# Altium schematic sheet 7segment.SchDoc
size A
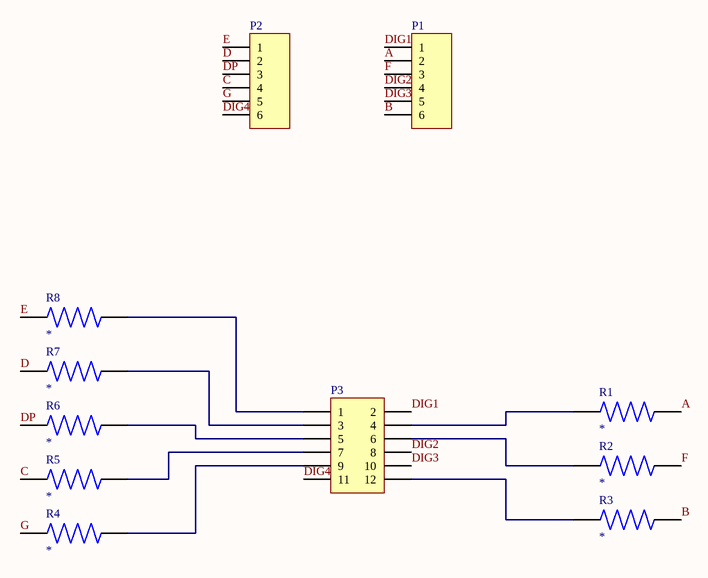
[diagram p0: 7segment.SchDoc]

## Parts
P1  Header 6  [HDR1X6]  (value not drawn)
P2  Header 6  [HDR1X6]  (value not drawn)
P3  Header 6X2  [HDR2X6]  (value not drawn)
R1  1623401-1  [RESC2012X65N]  (value not drawn)
R2  1623401-1  [RESC2012X65N]  (value not drawn)
R3  1623401-1  [RESC2012X65N]  (value not drawn)
R4  1623401-1  [RESC2012X65N]  (value not drawn)
R5  1623401-1  [RESC2012X65N]  (value not drawn)
R6  1623401-1  [RESC2012X65N]  (value not drawn)
R7  1623401-1  [RESC2012X65N]  (value not drawn)
R8  1623401-1  [RESC2012X65N]  (value not drawn)

## Nets
A: P1.2 R1.2
B: P1.6 R3.2
C: P2.4 R5.2
D: P2.2 R7.2
DIG1: P1.1 P3.2
DIG2: P1.4 P3.8
DIG3: P1.5 P3.10
DIG4: P2.6 P3.11
DP: P2.3 R6.2
E: P2.1 R8.2
F: P1.3 R2.2
G: P2.5 R4.2
NetP3_1: P3.1 R8.1
NetP3_3: P3.3 R7.1
NetP3_4: P3.4 R1.1
NetP3_5: P3.5 R6.1
NetP3_6: P3.6 R2.1
NetP3_7: P3.7 R5.1
NetP3_9: P3.9 R4.1
NetP3_12: P3.12 R3.1

## Library data of the parts
P1 P2 = Header 6: Header, 6-Pin; LatestRevisionDate: 17-Jul-2002; LatestRevisionNote: Re-released for DXP Platform.; Publisher: Altium Limited
P3 = Header 6X2: Header, 6-Pin, Dual row; LatestRevisionDate: 17-Jul-2002; LatestRevisionNote: Re-released for DXP Platform.; Publisher: Altium Limited
R1-R8 = CRG0805ZR: Res Thick Film 0805 0 Ohm Molded SMD SMD T/R; Power_Rating: .125 W; Resistance: 0; Tolerance: 0%; Voltage_Rating: 150 V; MF: TE Connectivity; Package: 0805; Availability: Unavailable; TE_purchase_URL: https://www.te.com/usa-en/product-1623401-1.html?te_bu=Cor&te_type=disp&te_campaign=seda_glo_cor-seda-global-disp-prtnr-fy19-seda-model-bom-cta_sma-317_1&elqCampaignId=32493; MP: CRG0805ZR; EU_RoHS_Compliance: Compliant with Exemptions; SnapEDA_Link: https://www.snapeda.com/parts/CRG0805ZR/TE%20Connectivity%20Passive%20Product/view-part/218184/?ref=snap; Value: *; Price: None; Comment_1: *